# Altium project ControllerV0.PrjPcb (part 2 of 3)
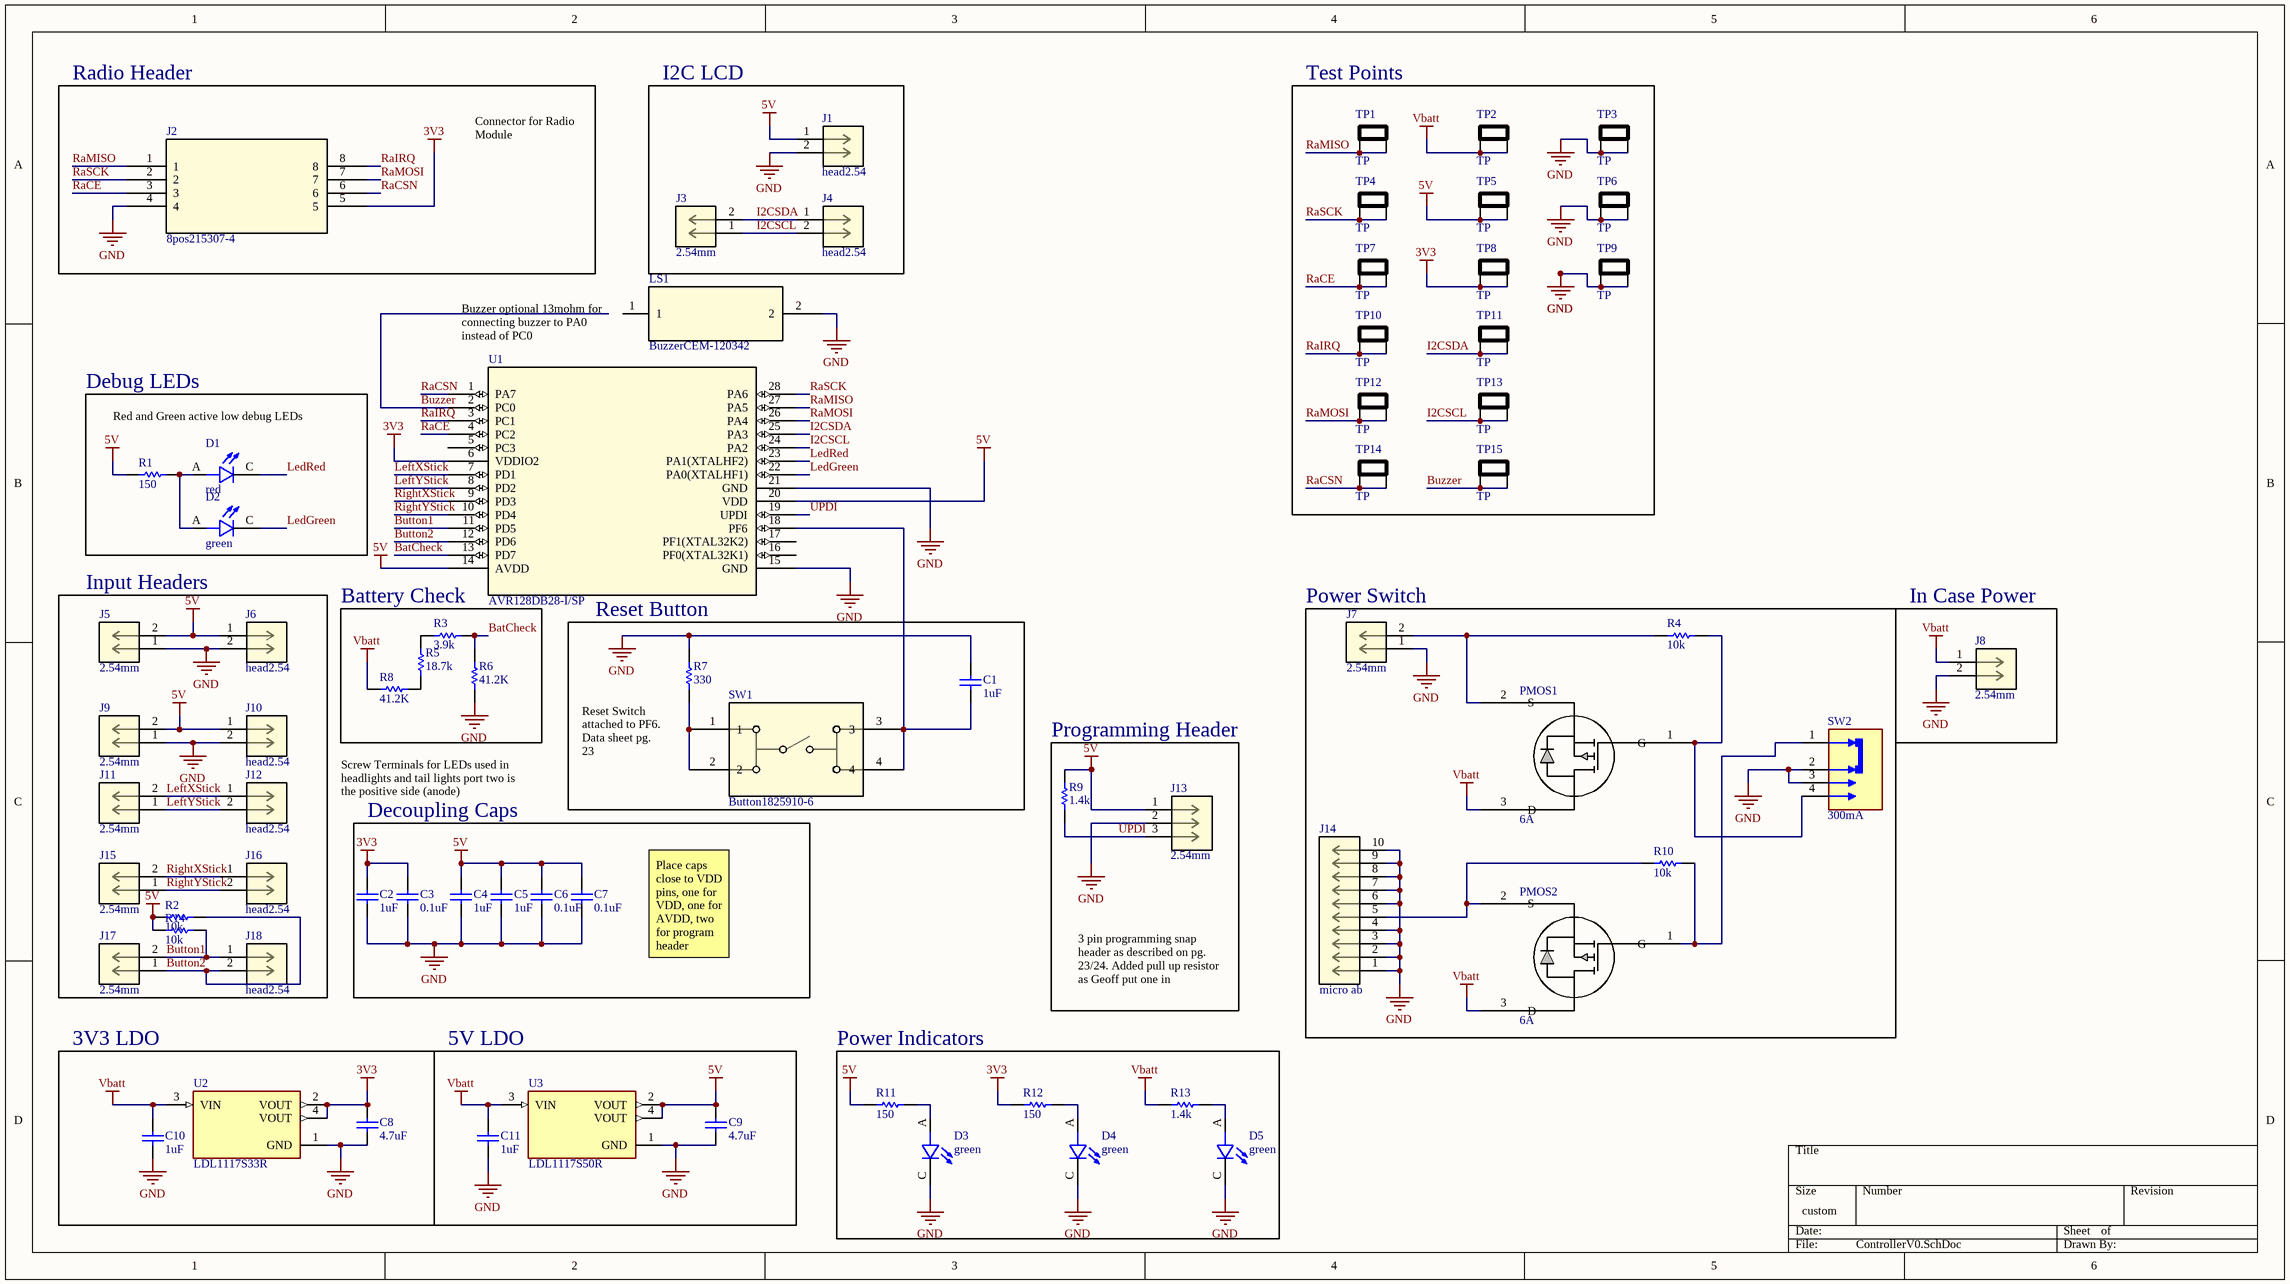
[diagram p1: ControllerV0.SchDoc]

## Sheet ControllerV0.SchDoc (continued)
### Library data of the parts
C1 C2 C4 C5 C10 C11 = CAP CER 1uF 10% 50V 0805: Ceramic Capacitor, Multilayer, Ceramic, 50V, 10% +Tol, 10% -Tol, X7R, 15% TC, 1uF, Surface Mount, 0805; Manufacturer: Samsung; Manufacturer Part Number: CL21B105KBFNNNE; Multilayer: Yes; Supplier: Digikey; Supplier Part Number: 1276-1029-1-ND; RoHS: Yes; Category: Ceramic Capacitors; Stock: 572828; Pricing: 1=0.1, 10=0.051, 100=0.0321, 1000=0.02181 (USD); Mounting Technology: Surface Mount; Pins: 2; Dielectric Material: Ceramic; Package Shape: Rectangular; Case/Package: 0805; Terminal Finish: Nickel; Min Operating Temperature: -55°C; Max Operating Temperature: 125°C; JESD-609 Code: e3; Value: 1uF; Capacitor Type: Ceramic; Tolerance  (fill in as +-): 10%; Package Style: SMTMeter; Packaging: Tape and Reel; Tolerance (fill in as +-): 10%; Rated DC Voltage (URdc): 50V; Temperature Characteristics Code: X7R; Termination: Wraparound; Length: 2mm; Width: 1.25mm; Height: 1.35mm; Reach SVHC Compliant: Yes; RoHS Compliant: Yes; ComponentLink1URL: https://datasheet.ciiva.com:443/pdfs/VipMasterIC/IC/SEMS/SEMS-S-A0008524728/SEMS-S-A0008523023-1.pdf?src-supplier=IHS+Markit; ComponentLink1Description: https://datasheet.ciiva.com:443/pdfs/VipMasterIC/IC/SEMS/SEMS-S-A0008524728/SEMS-S-A0008523023-1.pdf?src-supplier=IHS+Markit; ComponentLink2URL: https://datasheet.ciiva.com/25800/cl21b105kbfnnne-25800291.pdf?src-supplier=Digikey; ComponentLink2Description: https://datasheet.ciiva.com/25800/cl21b105kbfnnne-25800291.pdf?src-supplier=Digikey; ComponentLink3URL: https://datasheet.ciiva.com/16449/cl21b105kbfnnne-16449003.pdf?src-supplier=Future+Electronics; ComponentLink3Description: https://datasheet.ciiva.com/16449/cl21b105kbfnnne-16449003.pdf?src-supplier=Future+Electronics
C3 C6 C7 = CAP CER 0.1uF 10% 50V 0805: Ceramic Capacitor, Multilayer, Ceramic, 50V, 10% +Tol, 10% -Tol, X7R, 15% TC, 0.1uF, Surface Mount, 0805; Manufacturer: Yageo; Manufacturer Part Number: CC0805KRX7R9BB104; Value: 100nF; Multilayer: Yes; Supplier: Digikey; Supplier Part Number: 311-1140-1-ND; RoHS: Yes; Category: Ceramic Capacitors; Stock: 3691132; Pricing: 1=0.08, 10=0.021, 100=0.0152, 1000=0.0144, 4000=0.0112, 8000=0.0104, 12000=0.01, 20000=0.00985 (USD); Mounting Technology: Surface Mount; Pins: 2; Dielectric Material: Ceramic; Package Shape: Rectangular; Case/Package: 0805; Terminal Finish: Nickel; Min Operating Temperature: -55°C; Max Operating Temperature: 125°C; JESD-609 Code: e3; Capacitor Type: Ceramic; Tolerance  (fill in as +-): 10%; Package Style: SMTMeter; Packaging: Tape and Reel; Tolerance (fill in as +-): 10%; Rated DC Voltage (URdc): 50V; Temperature Characteristics Code: X7R; Termination: Wraparound; Length: 2mm; Width: 1.25mm; Height: 0.85mm; Reach SVHC Compliant: Yes; RoHS Compliant: Yes; ComponentLink1URL: https://datasheet.ciiva.com:443/pdfs/VipMasterIC/IC/YAGO/YAGO-S-A0003557223/YAGO-S-A0003557223-1.pdf?src-supplier=IHS+Markit; ComponentLink1Description: https://datasheet.ciiva.com:443/pdfs/VipMasterIC/IC/YAGO/YAGO-S-A0003557223/YAGO-S-A0003557223-1.pdf?src-supplier=IHS+Markit; ComponentLink2URL: https://datasheet.ciiva.com/11786/0900766b80d84f1d-11786009.pdf?src-supplier=Rs; ComponentLink2Description: https://datasheet.ciiva.com/11786/0900766b80d84f1d-11786009.pdf?src-supplier=Rs; ComponentLink3URL: https://datasheet.ciiva.com/155/mlccorderingcode-155929.pdf?src-supplier=Digikey; ComponentLink3Description: https://datasheet.ciiva.com/155/mlccorderingcode-155929.pdf?src-supplier=Digikey; ComponentLink4URL: https://datasheet.ciiva.com/155/mlccorderingcode-155930.pdf?src-supplier=Digikey; ComponentLink4Description: https://datasheet.ciiva.com/155/mlccorderingcode-155930.pdf?src-supplier=Digikey; ComponentLink5URL: https://datasheet.ciiva.com/155/mlccorderingcode-155931.pdf?src-supplier=Digikey; ComponentLink5Description: https://datasheet.ciiva.com/155/mlccorderingcode-155931.pdf?src-supplier=Digikey; ComponentLink6URL: https://datasheet.ciiva.com/46393/1734573-46393307.pdf?src-supplier=Element14; ComponentLink6Description: https://datasheet.ciiva.com/46393/1734573-46393307.pdf?src-supplier=Element14; ComponentLink7URL: https://datasheet.ciiva.com/28450/1489800-28450805.pdf?src-supplier=Element14; ComponentLink7Description: https://datasheet.ciiva.com/28450/1489800-28450805.pdf?src-supplier=Element14; ComponentLink8URL: https://datasheet.ciiva.com/11464/upy-gphc-x7r-6-3v-to-50v-8-11464757.pdf?src-supplier=Avnet; ComponentLink8Description: https://datasheet.ciiva.com/11464/upy-gphc-x7r-6-3v-to-50v-8-11464757.pdf?src-supplier=Avnet; ComponentLink9URL: https://datasheet.ciiva.com/29242/445210-da-01-en-kerko-chip-0805-x7r-0-1uf-10proz-50vg-29242074.pdf?src-supplier=Conrad; ComponentLink9Description: https://datasheet.ciiva.com/29242/445210-da-01-en-kerko-chip-0805-x7r-0-1uf-10proz-50vg-29242074.pdf?src-supplier=Conrad
C8 C9 = CAP CER 4.7uF 10% 25V 0805: Ceramic Capacitor, Multilayer, Ceramic, 25V, 10% +Tol, 10% -Tol, X5R, 15% TC, 4.7uF, Surface Mount, 0805; Manufacturer: Samsung; Manufacturer Part Number: CL21A475KAQNNNE; Multilayer: Yes; ComponentLink1Description: https://www.digikey.ca/en/products/detail/samsung-electro-mechanics/CL21A475KAQNNNE/3886902; ComponentLink1URL: *; Supplier: Digikey; Supplier Part Number: 1276-1244-1-ND; RoHS: Yes; Category: Ceramic Capacitors; Stock: 2691488; Pricing: 1=0.1, 10=0.048, 100=0.03, 1000=0.02035 (USD); Mounting Technology: Surface Mount; Pins: 2; Dielectric Material: Ceramic; Package Shape: Rectangular; Case/Package: 0805; Terminal Finish: Nickel; Min Operating Temperature: -55°C; Max Operating Temperature: 85°C; JESD-609 Code: e3; Value: 4.7uF; Capacitor Type: Ceramic; Tolerance  (fill in as +-): 10%; Package Style: SMTMeter; Packaging: Tape and Reel; Tolerance (fill in as +-): 10%; Rated DC Voltage (URdc): 25V; Temperature Characteristics Code: X5R; Termination: Wraparound; Length: 2mm; Width: 1.25mm; Height: 1.4mm; Reach SVHC Compliant: Yes; RoHS Compliant: Yes; ComponentLink2URL: https://datasheet.ciiva.com:443/pdfs/VipMasterIC/IC/SEMS/SEMS-S-A0008528919/SEMS-S-A0008528938-1.pdf?src-supplier=IHS+Markit; ComponentLink2Description: https://datasheet.ciiva.com:443/pdfs/VipMasterIC/IC/SEMS/SEMS-S-A0008528919/SEMS-S-A0008528938-1.pdf?src-supplier=IHS+Markit; ComponentLink3URL: https://datasheet.ciiva.com/25798/cl21a475kaqnnne-25798882.pdf?src-supplier=Digikey; ComponentLink3Description: https://datasheet.ciiva.com/25798/cl21a475kaqnnne-25798882.pdf?src-supplier=Digikey
D1 = LED redSML-D12U1WT86: Single Color LED, Red, Diffused Milky White, 1.2mm; Manufacturer: Rohm; Shape: Rectangular; Forward Current: 20mA; Luminous Intensity-Nom: 63mcd; Channels: 1; Overall Height: 0.55mm; Reverse Voltage-Max: 5V; Supplier: Digikey; Supplier Part Number: SML-D12U1WT86CT-ND; Manufacturer Part Number: SML-D12U1WT86; RoHS: Yes; Category: LEDs; Stock: 145541; Pricing: 1=0.12, 10=0.081, 100=0.0556, 500=0.0438, 1000=0.03986 (USD); Mounting Technology: Surface Mount; Pins: 2; Color: Red; Min Operating Temperature: -40°C; Max Operating Temperature: 85°C; Lens Style: MILKY WHITE; Optoelectronic Device Type: SINGLE COLOR LED; Packaging: Tape and Reel; Size: 1.2mm; Terminal Pitch: 1.65mm; Reach SVHC Compliant: Yes; RoHS Compliant: Yes; ComponentLink1URL: https://datasheet.ciiva.com:443/pdfs/VipMasterIC/IC/ROHM/ROHM-S-A0002134492/ROHM-S-A0002134492-1.pdf?src-supplier=IHS+Markit; ComponentLink1Description: https://datasheet.ciiva.com:443/pdfs/VipMasterIC/IC/ROHM/ROHM-S-A0002134492/ROHM-S-A0002134492-1.pdf?src-supplier=IHS+Markit; ComponentLink2URL: https://www.rohm.com/datasheet/SML-D12U1W?src-supplier=Digikey; ComponentLink2Description: https://www.rohm.com/datasheet/SML-D12U1W?src-supplier=Digikey; ComponentLink3URL: https://datasheet.octopart.com/SML-D12U1WT86-Rohm-datasheet-68298509.pdf?src-supplier=Future+Electronics; ComponentLink3Description: https://datasheet.octopart.com/SML-D12U1WT86-Rohm-datasheet-68298509.pdf?src-supplier=Future+Electronics; ComponentLink4URL: https://datasheet.octopart.com/SML-D12U1WT86-ROHM-datasheet-142144710.pdf?src-supplier=TME; ComponentLink4Description: https://datasheet.octopart.com/SML-D12U1WT86-ROHM-datasheet-142144710.pdf?src-supplier=TME; Color@wavelength: Red; Terminal Finish: Gold; JESD-609 Code: e4; ComponentLink5URL: https://datasheet.ciiva.com:443/pdfs/VipMasterIC/IC/ROHM/ROHMS10041/ROHMS10041-1.pdf?src-supplier=IHS+Markit; ComponentLink5Description: https://datasheet.ciiva.com:443/pdfs/VipMasterIC/IC/ROHM/ROHMS10041/ROHMS10041-1.pdf?src-supplier=IHS+Markit; ComponentLink6URL: https://datasheet.ciiva.com/11774/0900766b80df3ada-11774020.pdf?src-supplier=Rs; ComponentLink6Description: https://datasheet.ciiva.com/11774/0900766b80df3ada-11774020.pdf?src-supplier=Rs; ComponentLink7URL: https://datasheet.ciiva.com/9324/sml-d1-9324826.pdf?src-supplier=Avnet; ComponentLink7Description: https://datasheet.ciiva.com/9324/sml-d1-9324826.pdf?src-supplier=Avnet; ComponentLink8URL: https://datasheet.ciiva.com/2110/sml-d1-2110375.pdf?src-supplier=Digikey; ComponentLink8Description: https://datasheet.ciiva.com/2110/sml-d1-2110375.pdf?src-supplier=Digikey; ComponentLink9URL: https://datasheet.ciiva.com/2110/sml-d1-2110376.pdf?src-supplier=Digikey; ComponentLink9Description: https://datasheet.ciiva.com/2110/sml-d1-2110376.pdf?src-supplier=Digikey; ComponentLink10URL: https://datasheet.ciiva.com/2110/sml-d1-2110377.pdf?src-supplier=Digikey; ComponentLink10Description: https://datasheet.ciiva.com/2110/sml-d1-2110377.pdf?src-supplier=Digikey
D2-D5 = LED greenSML-D12P8WT86: Single Color LED, Pure Green, Diffused Milky White, 1.2mm; Manufacturer: Rohm; Shape: Rectangular; Forward Current: 20mA; Luminous Intensity-Nom: 6.3mcd; Channels: 1; Reverse Voltage-Max: 5V; Overall Height: 0.55mm; Supplier: Digikey; Supplier Part Number: 846-SML-D12P8WT86CT-ND; Manufacturer Part Number: SML-D12P8WT86; RoHS: Yes; Category: LEDs; Stock: 24850; Pricing: 1=0.14, 10=0.094, 100=0.0648, 500=0.05124, 1000=0.04672 (USD); Mounting Technology: Surface Mount; Pins: 2; Color: Green; Color@wavelength: Green; Terminal Finish: Gold; Min Operating Temperature: -40°C; Max Operating Temperature: 85°C; JESD-609 Code: e4; Lens Style: Diffused; Optoelectronic Device Type: SINGLE COLOR LED; Packaging: Tape and Reel; Size: 1.2mm; Terminal Pitch: 1.65mm; Reach SVHC Compliant: Yes; RoHS Compliant: Yes; ComponentLink1URL: https://datasheet.ciiva.com:443/pdfs/VipMasterIC/IC/ROHM/ROHMS10041/ROHMS10041-1.pdf?src-supplier=IHS+Markit; ComponentLink1Description: https://datasheet.ciiva.com:443/pdfs/VipMasterIC/IC/ROHM/ROHMS10041/ROHMS10041-1.pdf?src-supplier=IHS+Markit; ComponentLink2URL: https://datasheet.ciiva.com/2110/sml-d1-2110417.pdf?src-supplier=Digikey; ComponentLink2Description: https://datasheet.ciiva.com/2110/sml-d1-2110417.pdf?src-supplier=Digikey; ComponentLink3URL: https://datasheet.ciiva.com/16488/rohm20sml-d12p8wt86-16488100.pdf?src-supplier=Future+Electronics; ComponentLink3Description: https://datasheet.ciiva.com/16488/rohm20sml-d12p8wt86-16488100.pdf?src-supplier=Future+Electronics; ComponentLink4URL: https://datasheet.ciiva.com/2110/sml-d1-2110418.pdf?src-supplier=Digikey; ComponentLink4Description: https://datasheet.ciiva.com/2110/sml-d1-2110418.pdf?src-supplier=Digikey; ComponentLink5URL: https://datasheet.ciiva.com/2110/sml-d1-2110419.pdf?src-supplier=Digikey; ComponentLink5Description: https://datasheet.ciiva.com/2110/sml-d1-2110419.pdf?src-supplier=Digikey; ComponentLink6URL: https://datasheet.ciiva.com/3161/sml-d1-3161420.pdf?src-supplier=Avnet; ComponentLink6Description: https://datasheet.ciiva.com/3161/sml-d1-3161420.pdf?src-supplier=Avnet
J1 J4 J6 J10 J12 J16 J18 = HEAD 2.54mm 2pos: Board Connector, 2 Contact(s), 1 Row(s), Male, Straight, 0.1 inch Pitch, Solder Terminal, Black Insulator; Manufacturer: Samtec; Manufacturer Part Number: TS-102-G-AA; Option: General Purpose; Contact Pattern: RECTANGULAR; Contact Style: RND PIN-SKT; Filter Feature: No; Mating Information: MULTIPLE MATING PARTS AVAILABLE; Number Of Connectors: 1; Number of Contacts: 2; Body Length: 0.2inch; Plating Thickness: 20uin; Reference Standard: UL; Reliability: COMMERCIAL; Supplier: Digikey; Supplier Part Number: 612-TS-102-G-AA-ND; RoHS: Yes; Category: Connectors; Stock: 9; Pricing: 1=0.7, 50=0.54, 100=0.44, 500=0.37, 1000=0.36 (USD); Mounting Technology: Board; Contact Material: Brass; Contact Finish - Mating: GOLD (20) OVER NICKEL (50); Contact Finish - Termination: Gold (Au) - with Nickel (Ni) barrier; Insulation Color: Black; Insulation Material: Glass; Min Operating Temperature: -55°C; Max Operating Temperature: 125°C; Connector Type: BOARD CONNECTOR; JESD-609 Code: e4; Contact Gender: Male; Mixed Contacts: No; Mounting Style: STRAIGHT; Number Of PCB Rows: 1; Number of Rows Loaded: 1; PCB Contact Pattern: RECTANGULAR; Termination: Solder; Body Breadth: 0.1inch; Mating Contact Pitch: 0.1inch; Terminal Pitch: 2.54mm; Terminal Length: 0.156inch; DIN Conformance: No; IEC Conformance: No; MIL Conformance: No; RoHS Compliant: Yes; Reach SVHC Compliant: No; ComponentLink1URL: https://datasheet.ciiva.com:443/pdfs/VipMasterIC/IC/SAMI/SAMI-S-A0002822123/SAMI-S-A0002822123-1.pdf?src-supplier=IHS+Markit; ComponentLink1Description: https://datasheet.ciiva.com:443/pdfs/VipMasterIC/IC/SAMI/SAMI-S-A0002822123/SAMI-S-A0002822123-1.pdf?src-supplier=IHS+Markit; ComponentLink2URL: http://www.farnell.com/datasheets/1843794.pdf?src-supplier=Farnell; ComponentLink2Description: http://www.farnell.com/datasheets/1843794.pdf?src-supplier=Farnell; ComponentLink3URL: ftp://ftp.samtec.com/webfiles/PDF/ts.pdf?src-supplier=Avnet; ComponentLink3Description: ftp://ftp.samtec.com/webfiles/PDF/ts.pdf?src-supplier=Avnet; ComponentLink4URL: https://datasheet.octopart.com/TS-102-G-AA-Samtec-datasheet-13698575.pdf?src-supplier=Newark; ComponentLink4Description: https://datasheet.octopart.com/TS-102-G-AA-Samtec-datasheet-13698575.pdf?src-supplier=Newark; ComponentLink5URL: https://datasheet.octopart.com/TS-102-G-AA-Samtec-datasheet-97318998.pdf?src-supplier=Samtec; ComponentLink5Description: https://datasheet.octopart.com/TS-102-G-AA-Samtec-datasheet-97318998.pdf?src-supplier=Samtec; ComponentLink6URL: https://datasheet.octopart.com/TS-102-G-AA-Samtec-datasheet-118235246.pdf?src-supplier=Sager+Electronics; ComponentLink6Description: https://datasheet.octopart.com/TS-102-G-AA-Samtec-datasheet-118235246.pdf?src-supplier=Sager+Electronics; ComponentLink7URL: https://datasheet.octopart.com/TS-102-G-AA-Samtec-datasheet-150856305.pdf?src-supplier=Electro+Sonic; ComponentLink7Description: https://datasheet.octopart.com/TS-102-G-AA-Samtec-datasheet-150856305.pdf?src-supplier=Electro+Sonic
J2 = 8pos215307-4: Board Connector, 4 Contact(s), 2 Row(s), Female, Straight, 0.1 inch Pitch, Solder Terminal, Black Insulator, Receptacle; Manufacturer: TE Connectivity; Option: General Purpose; Contact Pattern: RECTANGULAR; Contact Style: BELLOWED TYPE; Dielectric Withstanding Voltage (AC): 750V; Filter Feature: No; Insulation Resistance: 5GR; Number Of Connectors: 1; Number Of PCB Rows: 2; Number of Contacts: 8; Body Breadth: 0.199inch; Body Depth: 0.276inch; PCB Contact Row Spacing: 2.54mm; Plating Thickness: 31uin; Reference Standard: UL; Reliability: COMMERCIAL; Supplier: Avnet; Supplier Part Number: 98K6517; Manufacturer Part Number: 215307-4; RoHS: Yes; Category: Headers and Wire Housings; Stock: 250; Pricing: 1=0.863, 10=0.776, 25=0.761, 50=0.746, 100=0.731 (USD); Mounting Technology: Board; Contact Material: Bronze; Contact Finish - Mating: NOT SPECIFIED; Contact Finish - Termination: Tin (Sn); Insulation Color: Green; Insulation Material: Glass; Min Operating Temperature: -65°C; Max Operating Temperature: 125°C; JESD-609 Code: e3; Connector Type: BOARD CONNECTOR; Body/Shell Style: RECEPTACLE; Contact Gender: Female; Mixed Contacts: No; Mounting Style: STRAIGHT; Number of Rows Loaded: 2; PCB Contact Pattern: RECTANGULAR; Termination: Solder; Mating Contact Pitch: 0.1inch; Mating Contact Row Spacing: 0.1inch; Terminal Length: 0.118inch; Terminal Pitch: 2.54mm; Flammability Rating: UL94 V-0; Reach SVHC Compliant: Yes; RoHS Compliant: Yes; DIN Conformance: No; IEC Conformance: No; MIL Conformance: No; ComponentLink1URL: https://www.te.com:443/usa-en/product-215307-4.html?src-supplier=IHS+Markit; ComponentLink1Description: https://www.te.com:443/usa-en/product-215307-4.html?src-supplier=IHS+Markit; ComponentLink2URL: https://datasheet.ciiva.com/30070/2153074-30070134.pdf?src-supplier=Onlinecomponents.com; ComponentLink2Description: https://datasheet.ciiva.com/30070/2153074-30070134.pdf?src-supplier=Onlinecomponents.com; ComponentLink3URL: https://datasheet.ciiva.com/11748/0900766b804f4b20-11748752.pdf?src-supplier=Rs; ComponentLink3Description: https://datasheet.ciiva.com/11748/0900766b804f4b20-11748752.pdf?src-supplier=Rs; ComponentLink4URL: https://datasheet.ciiva.com/29369/001094904-da-01-en-buchsenleiste-2-reihig-0-0215307-4-29369976.pdf?src-supplier=Conrad; ComponentLink4Description: https://datasheet.ciiva.com/29369/001094904-da-01-en-buchsenleiste-2-reihig-0-0215307-4-29369976.pdf?src-supplier=Conrad; ComponentLink5URL: https://datasheet.ciiva.com/6857/eng-cd-215307-d-basefilename-6857485.pdf?src-supplier=Digikey; ComponentLink5Description: https://datasheet.ciiva.com/6857/eng-cd-215307-d-basefilename-6857485.pdf?src-supplier=Digikey
J3 J5 J7-J9 J11 J15 J17 = CON screw 2pos 2.54mm: Barrier Strip Terminal Block, 6A, 1 Row(s), 1 Deck(s); Manufacturer: On-Shore Technology; Manufacturer Part Number: OSTVN02A150; Fastening Method: SCREW; Additional Feature: STANDARD: UL 94V-0, THERMOPLASTIC; Number of Decks: 1; Number of Ways: 2; Voltage Rating: 125V; Wire/Cable Gauge: 20AWG; Safety Approval: UL,CUL; Supplier: Digikey; Supplier Part Number: ED10561-ND; RoHS: Yes; Category: Terminal Blocks; Stock: 5554; Pricing: 1=0.87, 10=0.64, 25=0.5576, 50=0.5028, 100=0.4549, 250=0.40308, 500=0.37178, 1000=0.34649, 5000=0.30612 (USD); Mounting Technology: Board; Number of Rows: 1; Current Rating: 6A; Terminal and Terminal Block Type: BARRIER STRIP TERMINAL BLOCK; Reach SVHC Compliant: Yes; RoHS Compliant: Yes; ComponentLink1URL: https://datasheet.ciiva.com:443/pdfs/VipMasterIC/IC/ONST/ONSTS00240/ONSTS00114-1.pdf?src-supplier=IHS+Markit; ComponentLink1Description: https://datasheet.ciiva.com:443/pdfs/VipMasterIC/IC/ONST/ONSTS00240/ONSTS00114-1.pdf?src-supplier=IHS+Markit; ComponentLink2URL: https://datasheet.ciiva.com/823/ostvnxxa150-823935.pdf?src-supplier=Digikey; ComponentLink2Description: https://datasheet.ciiva.com/823/ostvnxxa150-823935.pdf?src-supplier=Digikey
J13 = HEAD 2.54mm 3pos: Board Connector, 38 Contact(s), 1 Row(s), Male, Straight, 0.1 inch Pitch, Solder Terminal, Black Insulator; Manufacturer: Samtec; Manufacturer Part Number: TS-103-T-A; Manufacturer Series: TS; Option: General Purpose; Filter Feature: No; Mating Information: MULTIPLE MATING PARTS AVAILABLE; Number of Rows Loaded: 1; Number of Contacts: 38; Contact Pattern: RECTANGULAR; Contact Style: RND PIN-SKT; Body Length: 0.3inch; Plating Thickness: 200uin; Reference Standard: UL; Reliability: COMMERCIAL; Supplier: Digikey; Supplier Part Number: SAM1112-03-ND; RoHS: Yes; Category: Connectors; Stock: 8991; Pricing: 1=0.81, 10=0.689, 100=0.5855, 500=0.5226, 1000=0.49765, 5000=0.47207 (USD); Mounting Technology: Board; Contact Material: Brass; Contact Finish - Mating: TIN OVER COPPER (100); Contact Finish - Termination: TIN OVER COPPER (100); Insulation Color: Black; Insulation Material: Glass; Min Operating Temperature: -55°C; Max Operating Temperature: 105°C; Connector Type: BOARD CONNECTOR; Contact Gender: Male; Mixed Contacts: No; Mounting Style: STRAIGHT; Termination: Solder; JESD-609 Code: e3; Number Of Connectors: 1; Number Of PCB Rows: 1; PCB Contact Pattern: RECTANGULAR; Terminal Pitch: 2.54mm; Body Breadth: 0.1inch; Mating Contact Pitch: 0.1inch; Terminal Length: 0.156inch; DIN Conformance: No; IEC Conformance: No; MIL Conformance: No; RoHS Compliant: Yes; Reach SVHC Compliant: No; ComponentLink1URL: https://datasheet.ciiva.com:443/pdfs/VipMasterIC/IC/SAMI/SAMI-S-A0001504555/SAMI-S-A0001504555-1.pdf?src-supplier=IHS+Markit; ComponentLink1Description: https://datasheet.ciiva.com:443/pdfs/VipMasterIC/IC/SAMI/SAMI-S-A0001504555/SAMI-S-A0001504555-1.pdf?src-supplier=IHS+Markit; ComponentLink2URL: https://datasheet.ciiva.com/410/tx-1xx-x-x-mkt1-410199.pdf?src-supplier=Digikey; ComponentLink2Description: https://datasheet.ciiva.com/410/tx-1xx-x-x-mkt1-410199.pdf?src-supplier=Digikey
J14 = CON USB micro ab: USB Connector, 5 Contact(s), Female, Right Angle, Surface Mount Terminal, Locking, Receptacle; Manufacturer: Molex; Manufacturer Part Number: 47590-0001; Connector Type: TELECOM AND DATACOM CONNECTOR; Option: General Purpose; Additional Feature: Shielded; Board Mounting Option: PEG; Contact Resistance: 30mR; Dielectric Withstanding Voltage (AC): 141V; Durability: 10000Cycles; Empty Shell: No; Insulation Resistance: 1GR; Number Of Connectors: 1; PCB Contact Pattern: RECTANGULAR; Polarization Key: POLAR PIN POSITION; Rated Current (Signal): 1A; Number of Contacts: 5; Body Breadth: 0.118inch; Body Depth: 0.232inch; Body Length: 0.295inch; Reference Standard: UL; Reliability: COMMERCIAL; Supplier: Digikey; Supplier Part Number: WM17144CT-ND; RoHS: Yes; Category: USB Connectors; Stock: 37888; Pricing: 1=0.75, 10=0.636, 25=0.5964, 50=0.568, 100=0.5408, 250=0.50688, 500=0.48264 (USD); Mounting Technology: Cable; Contact Material: Copper Alloy; Contact Finish - Mating: GOLD; Contact Finish - Termination: Gold (Au); Insulation Material: Polymer; Shell Finish: Tin; Shell Material: Stainless Steel; Min Operating Temperature: -30°C; Max Operating Temperature: 85°C; JESD-609 Code: e4; Body/Shell Style: RECEPTACLE; Contact Gender: Female; Filter Feature: No; Mixed Contacts: No; Mounting Style: RIGHT ANGLE; Number Of PCB Rows: 1; Termination: SMD/SMT; Mounting Option 1: LOCKING; Terminal Pitch: 0.6604mm; Reach SVHC Compliant: Yes; RoHS Compliant: Yes; DIN Conformance: No; IEC Conformance: No; MIL Conformance: No; ComponentLink1URL: https://datasheet.ciiva.com:443/pdfs/VipMasterIC/IC/MOLE/MOLE-S-A0000442751/MOLE-S-A0000443003-1.pdf?src-supplier=IHS+Markit; ComponentLink1Description: https://datasheet.ciiva.com:443/pdfs/VipMasterIC/IC/MOLE/MOLE-S-A0000442751/MOLE-S-A0000443003-1.pdf?src-supplier=IHS+Markit; ComponentLink2URL: https://datasheet.ciiva.com/11731/0900766b80dfe0a6-11731294.pdf?src-supplier=Rs; ComponentLink2Description: https://datasheet.ciiva.com/11731/0900766b80dfe0a6-11731294.pdf?src-supplier=Rs; ComponentLink3URL: https://datasheet.ciiva.com/1098/1597781-1098479.pdf?src-supplier=Element14; ComponentLink3Description: https://datasheet.ciiva.com/1098/1597781-1098479.pdf?src-supplier=Element14; ComponentLink4URL: https://datasheet.ciiva.com/16148/0475900001-io-connectors-16148922.pdf?src-supplier=Onlinecomponents.com; ComponentLink4Description: https://datasheet.ciiva.com/16148/0475900001-io-connectors-16148922.pdf?src-supplier=Onlinecomponents.com
LS1 = BuzzerCEM-120342: Audio Signaling/Alarm Devices; Manufacturer: CUI Devices; Supplier: Arrow Electronics; Supplier Part Number: CEM-1203(42); Manufacturer Part Number: CEM-1203(42); RoHS: Yes; Category: Buzzers; Stock: 12257; Pricing: 1=0.5383, 10=0.4658, 25=0.4267, 40=0.4109, 80=0.3857, 230=0.3659, 500=0.365 (USD); ComponentLink1URL: https://www.cuidevices.com/product/resource/digikeypdf/cem-1203-42-.pdf?src-supplier=Digikey; ComponentLink1Description: https://www.cuidevices.com/product/resource/digikeypdf/cem-1203-42-.pdf?src-supplier=Digikey; ComponentLink2URL: https://datasheet.octopart.com/CEM-1203%2842%29-CUI-Devices-datasheet-175926661.pdf?src-supplier=Future+Electronics; ComponentLink2Description: https://datasheet.octopart.com/CEM-1203%2842%29-CUI-Devices-datasheet-175926661.pdf?src-supplier=Future+Electronics; ComponentLink3URL: https://datasheet.octopart.com/CEM-1203%2842%29-Same-Sky-datasheet-182879445.pdf?src-supplier=Electro+Sonic; ComponentLink3Description: https://datasheet.octopart.com/CEM-1203%2842%29-Same-Sky-datasheet-182879445.pdf?src-supplier=Electro+Sonic; ComponentLink4URL: https://datasheet.octopart.com/CEM-1203%2842%29-CUI-Devices-datasheet-175925305.pdf?src-supplier=Master+Electronics; ComponentLink4Description: https://datasheet.octopart.com/CEM-1203%2842%29-CUI-Devices-datasheet-175925305.pdf?src-supplier=Master+Electronics
PMOS1 PMOS2 = MOS PMOS 30V 6A: Power Field-Effect Transistor, 6A I(D), 30V, 0.042ohm, 1-Element, P-Channel, Silicon, Metal-oxide Semiconductor FET; Manufacturer: Toshiba; Manufacturer Part Number: SSM3J372R,LF; Supplier: Digikey; Supplier Part Number: SSM3J372RLFCT-ND; RoHS: No; Category: LDO; Stock: 64640; Pricing: 1=0.35, 10=0.217, 100=0.1361, 500=0.10106, 1000=0.08971 (USD)
R1 R11 R12 = RES 150 1% 0.125 0805: Fixed Resistor, Metal Glaze/thick Film, 0.125W, 150ohm, 150V, 1% +/-Tol, 100ppm/Cel, Surface Mount, 0805; Manufacturer: Yageo; Manufacturer Part Number: RC0805FR-07150RL; Additional Feature: LASER TRIMMABLE; Power: 125mW; Rated Temperature: 70°C; Value: 150R; Temperature Coefficient (ppm/Cel): 100; Package Height: 0.5mm; Package Length: 2mm; Package Width: 1.25mm; Supplier: Digikey; Supplier Part Number: 311-150CRCT-ND; RoHS: Yes; Category: Chip SMD Resistors; Stock: 982514; Pricing: 1=0.1, 10=0.014, 100=0.0112, 1000=0.00918 (USD); Mounting Technology: Surface Mount; Pins: 2; Package Shape: Rectangular; Case/Package: 0805; Terminal Finish: Nickel; Min Operating Temperature: -55°C; Max Operating Temperature: 155°C; Tolerance: 1%; JESD-609 Code: e3; Resistor Type: FIXED RESISTOR; Construction: Chip; Packaging: Tape and Reel; Technology: METAL GLAZE/THICK FILM; Termination: Wraparound; Working Voltage: 150V; Reach SVHC Compliant: Yes; RoHS Compliant: Yes; ComponentLink1URL: https://datasheet.ciiva.com:443/pdfs/VipMasterIC/IC/YAGO/YAGO-S-A0008145938/YAGO-S-A0008145938-1.pdf?src-supplier=IHS+Markit; ComponentLink1Description: https://datasheet.ciiva.com:443/pdfs/VipMasterIC/IC/YAGO/YAGO-S-A0008145938/YAGO-S-A0008145938-1.pdf?src-supplier=IHS+Markit; ComponentLink2URL: https://datasheet.ciiva.com/11819/0900766b8106beab-11819782.pdf?src-supplier=Rs; ComponentLink2Description: https://datasheet.ciiva.com/11819/0900766b8106beab-11819782.pdf?src-supplier=Rs; ComponentLink3URL: https://datasheet.ciiva.com/2456/pyu-r-int-thick-7-2456999.pdf?src-supplier=Digikey; ComponentLink3Description: https://datasheet.ciiva.com/2456/pyu-r-int-thick-7-2456999.pdf?src-supplier=Digikey; ComponentLink4URL: https://datasheet.ciiva.com/2457/pyu-r-int-thick-7-2457000.pdf?src-supplier=Digikey; ComponentLink4Description: https://datasheet.ciiva.com/2457/pyu-r-int-thick-7-2457000.pdf?src-supplier=Digikey; ComponentLink5URL: https://datasheet.ciiva.com/2457/pyu-r-int-thick-7-2457001.pdf?src-supplier=Digikey; ComponentLink5Description: https://datasheet.ciiva.com/2457/pyu-r-int-thick-7-2457001.pdf?src-supplier=Digikey; ComponentLink6URL: https://datasheet.ciiva.com/7660/38627-7660798.pdf?src-supplier=Element14; ComponentLink6Description: https://datasheet.ciiva.com/7660/38627-7660798.pdf?src-supplier=Element14; ComponentLink7URL: https://datasheet.ciiva.com/46447/444164-46447566.pdf?src-supplier=Element14; ComponentLink7Description: https://datasheet.ciiva.com/46447/444164-46447566.pdf?src-supplier=Element14; ComponentLink8URL: https://datasheet.ciiva.com/12668/rc0805-12668251.pdf?src-supplier=Mouser; ComponentLink8Description: https://datasheet.ciiva.com/12668/rc0805-12668251.pdf?src-supplier=Mouser
R2 R4 R10 R14 = RES 10k 1% 0.125 0805: Fixed Resistor, Metal Glaze/thick Film, 0.125W, 10000ohm, 150V, 1% +/-Tol, 100ppm/Cel, Surface Mount, 0805; Manufacturer: Stackpole Electronics; Manufacturer Part Number: RMCF0805FT10K0; Power: 125mW; Rated Temperature: 70°C; Value: 10kR; Temperature Coefficient (ppm/Cel): 100; Package Height: 0.5mm; Package Length: 2mm; Package Width: 1.25mm; Reference Standard: AEC-Q200; Supplier: Digikey; Supplier Part Number: RMCF0805FT10K0CT-ND; RoHS: Yes; Category: Chip SMD Resistors; Stock: 1401146; Pricing: 1=0.1, 10=0.025, 100=0.012, 1000=0.00658, 2500=0.00538 (USD); Mounting Technology: Surface Mount; Pins: 2; Package Shape: Rectangular; Case/Package: 0805; Terminal Finish: Nickel; Min Operating Temperature: -55°C; Max Operating Temperature: 155°C; Tolerance: 1%; JESD-609 Code: e3; Resistor Type: FIXED RESISTOR; Construction: Rectangular; Packaging: Tape and Reel; Technology: METAL GLAZE/THICK FILM; Termination: Wraparound; Working Voltage: 150V; Reach SVHC Compliant: Yes; RoHS Compliant: Yes; ComponentLink1URL: https://datasheet.ciiva.com:443/pdfs/VipMasterIC/IC/SEIE/SEIE-S-A0009541969/SEIE-S-A0009541969-1.pdf?src-supplier=IHS+Markit; ComponentLink1Description: https://datasheet.ciiva.com:443/pdfs/VipMasterIC/IC/SEIE/SEIE-S-A0009541969/SEIE-S-A0009541969-1.pdf?src-supplier=IHS+Markit; ComponentLink2URL: https://datasheet.ciiva.com/15193/getdatasheetpartid-362046-15193525.pdf?src-supplier=Verical; ComponentLink2Description: https://datasheet.ciiva.com/15193/getdatasheetpartid-362046-15193525.pdf?src-supplier=Verical
R3 = RES 3.9k 1% 0.125W 0805: Fixed Resistor, Metal Glaze/thick Film, 0.125W, 3920ohm, 150V, 1% +/-Tol, 100ppm/Cel, Surface Mount, 0805; Manufacturer: Stackpole Electronics; Manufacturer Part Number: RMCF0805FT3K92; Power: 125mW; Rated Temperature: 70°C; Value: 3.92kR; Temperature Coefficient (ppm/Cel): 100; Package Height: 0.5mm; Package Length: 2mm; Package Width: 1.25mm; Reference Standard: AEC-Q200; Supplier: Digikey; Supplier Part Number: RMCF0805FT3K92CT-ND; RoHS: Yes; Category: Chip SMD Resistors; Stock: 141516; Pricing: 1=0.1, 10=0.021, 50=0.0128, 100=0.0105, 500=0.00704, 1000=0.00602 (USD); Mounting Technology: Surface Mount; Pins: 2; Package Shape: Rectangular; Case/Package: 0805; Terminal Finish: Nickel; Min Operating Temperature: -55°C; Max Operating Temperature: 155°C; Tolerance: 1%; JESD-609 Code: e3; Resistor Type: FIXED RESISTOR; Construction: Rectangular; Packaging: Tape and Reel; Technology: METAL GLAZE/THICK FILM; Termination: Wraparound; Working Voltage: 150V; Reach SVHC Compliant: Yes; RoHS Compliant: Yes; ComponentLink1URL: https://datasheet.ciiva.com:443/pdfs/VipMasterIC/IC/SEIE/SEIE-S-A0009541969/SEIE-S-A0009541969-1.pdf?src-supplier=IHS+Markit; ComponentLink1Description: https://datasheet.ciiva.com:443/pdfs/VipMasterIC/IC/SEIE/SEIE-S-A0009541969/SEIE-S-A0009541969-1.pdf?src-supplier=IHS+Markit; ComponentLink2URL: https://datasheet.ciiva.com/3882/40960751s7172021n1174-3882844.pdf?src-supplier=Arrow+Electronics; ComponentLink2Description: https://datasheet.ciiva.com/3882/40960751s7172021n1174-3882844.pdf?src-supplier=Arrow+Electronics; ComponentLink3URL: https://datasheet.ciiva.com/15193/getdatasheetpartid-565526-15193591.pdf?src-supplier=Verical; ComponentLink3Description: https://datasheet.ciiva.com/15193/getdatasheetpartid-565526-15193591.pdf?src-supplier=Verical
R5 = RES 18.7k 1% 0.125W 0805: Fixed Resistor, Metal Glaze/thick Film, 0.125W, 18700ohm, 150V, 1% +/-Tol, 100ppm/Cel, Surface Mount, 0805; Manufacturer: Stackpole Electronics; Manufacturer Part Number: RMCF0805FT18K7; Power: 125mW; Rated Temperature: 70°C; Value: 18.7kR; Temperature Coefficient (ppm/Cel): 100; Package Height: 0.5mm; Package Length: 2mm; Package Width: 1.25mm; Reference Standard: AEC-Q200; Supplier: Digikey; Supplier Part Number: RMCF0805FT18K7CT-ND; RoHS: Yes; Category: Chip SMD Resistors; Stock: 214137; Pricing: 1=0.1, 10=0.025, 100=0.012, 1000=0.00628, 2500=0.00538 (USD); Mounting Technology: Surface Mount; Pins: 2; Package Shape: Rectangular; Case/Package: 0805; Terminal Finish: Nickel; Min Operating Temperature: -55°C; Max Operating Temperature: 155°C; Tolerance: 1%; JESD-609 Code: e3; Resistor Type: FIXED RESISTOR; Construction: Rectangular; Packaging: Tape and Reel; Technology: METAL GLAZE/THICK FILM; Termination: Wraparound; Working Voltage: 150V; Reach SVHC Compliant: Yes; RoHS Compliant: Yes; ComponentLink1URL: https://datasheet.ciiva.com:443/pdfs/VipMasterIC/IC/SEIE/SEIE-S-A0009541969/SEIE-S-A0009541969-1.pdf?src-supplier=IHS+Markit; ComponentLink1Description: https://datasheet.ciiva.com:443/pdfs/VipMasterIC/IC/SEIE/SEIE-S-A0009541969/SEIE-S-A0009541969-1.pdf?src-supplier=IHS+Markit; ComponentLink2URL: http://components.arrow.com/part/dataview/50586056S357577N1174?src-supplier=Arrow+Electronics; ComponentLink2Description: http://components.arrow.com/part/dataview/50586056S357577N1174?src-supplier=Arrow+Electronics; ComponentLink3URL: https://www.seielect.com/catalog/sei-rmcf_rmcp.pdf?src-supplier=Digikey; ComponentLink3Description: https://www.seielect.com/catalog/sei-rmcf_rmcp.pdf?src-supplier=Digikey; ComponentLink4URL: https://www.seielect.com/catalog/SEI-RMCF_RMCP.pdf?src-supplier=Avnet; ComponentLink4Description: https://www.seielect.com/catalog/SEI-RMCF_RMCP.pdf?src-supplier=Avnet; ComponentLink5URL: https://datasheet.octopart.com/RMCF0805FT18K7-Stackpole-Electronics-datasheet-28504820.pdf?src-supplier=Future+Electronics; ComponentLink5Description: https://datasheet.octopart.com/RMCF0805FT18K7-Stackpole-Electronics-datasheet-28504820.pdf?src-supplier=Future+Electronics
R6 R8 = RES 41.2K 1% 0.125W 0805: Fixed Resistor, Metal Glaze/thick Film, 0.125W, 41200ohm, 150V, 1% +/-Tol, 100ppm/Cel, Surface Mount, 0805; Manufacturer: Vishay; Manufacturer Part Number: CRCW080541K2FKEA; Power: 125mW; Value: 41.2kR; Temperature Coefficient (ppm/Cel): 100; Rated Temperature: 70°C; Package Height: 0.45mm; Package Length: 2mm; Package Width: 1.25mm; Reference Standard: AEC-Q200; Supplier: Arrow Electronics; Supplier Part Number: CRCW080541K2FKEA; RoHS: Yes; Category: Chip SMD Resistors; Stock: 1; Pricing: 1=0.0041 (USD); Mounting Technology: Surface Mount; Pins: 2; Case/Package: 0805; Terminal Finish: Nickel; Package Shape: Rectangular; Min Operating Temperature: -55°C; Max Operating Temperature: 155°C; Tolerance: 1%; JESD-609 Code: e3; Resistor Type: FIXED RESISTOR; Construction: Chip; Packaging: Tape and Reel; Technology: METAL GLAZE/THICK FILM; Working Voltage: 150V; Termination: Wraparound; Reach SVHC Compliant: Yes; RoHS Compliant: Yes; ComponentLink1URL: https://datasheet.ciiva.com:443/pdfs/VipMasterIC/IC/VISH/VISH-S-A0007266705/VISH-S-A0007266705-1.pdf?src-supplier=IHS+Markit; ComponentLink1Description: https://datasheet.ciiva.com:443/pdfs/VipMasterIC/IC/VISH/VISH-S-A0007266705/VISH-S-A0007266705-1.pdf?src-supplier=IHS+Markit; ComponentLink2URL: https://datasheet.ciiva.com/2467/dcrcwe3-2467875.pdf?src-supplier=Digikey; ComponentLink2Description: https://datasheet.ciiva.com/2467/dcrcwe3-2467875.pdf?src-supplier=Digikey; ComponentLink3URL: https://datasheet.ciiva.com/2467/dcrcwe3-2467876.pdf?src-supplier=Digikey; ComponentLink3Description: https://datasheet.ciiva.com/2467/dcrcwe3-2467876.pdf?src-supplier=Digikey; ComponentLink4URL: https://datasheet.ciiva.com/2467/dcrcwe3-2467877.pdf?src-supplier=Digikey; ComponentLink4Description: https://datasheet.ciiva.com/2467/dcrcwe3-2467877.pdf?src-supplier=Digikey; ComponentLink5URL: https://datasheet.ciiva.com/9009/dcrcwe3-9009672.pdf?src-supplier=Avnet; ComponentLink5Description: https://datasheet.ciiva.com/9009/dcrcwe3-9009672.pdf?src-supplier=Avnet; ComponentLink6URL: https://datasheet.ciiva.com/5552/dcrcwe3-109170-5552669.pdf?src-supplier=Mouser; ComponentLink6Description: https://datasheet.ciiva.com/5552/dcrcwe3-109170-5552669.pdf?src-supplier=Mouser; ComponentLink7URL: https://datasheet.ciiva.com/7671/1697337-7671701.pdf?src-supplier=Element14; ComponentLink7Description: https://datasheet.ciiva.com/7671/1697337-7671701.pdf?src-supplier=Element14; ComponentLink8URL: https://datasheet.ciiva.com/7725/125364-7725967.pdf?src-supplier=Element14; ComponentLink8Description: https://datasheet.ciiva.com/7725/125364-7725967.pdf?src-supplier=Element14; ComponentLink9URL: https://datasheet.ciiva.com/22702/1697337-22702910.pdf?src-supplier=Element14; ComponentLink9Description: https://datasheet.ciiva.com/22702/1697337-22702910.pdf?src-supplier=Element14; ComponentLink10URL: https://datasheet.ciiva.com/16200/dcrcwe3-16200485.pdf?src-supplier=Future+Electronics; ComponentLink10Description: https://datasheet.ciiva.com/16200/dcrcwe3-16200485.pdf?src-supplier=Future+Electronics
R7 = RES 330 1% 0.125W 0805: Fixed Resistor, Metal Glaze/thick Film, 0.125W, 330ohm, 150V, 1% +/-Tol, 100ppm/Cel, Surface Mount, 0805; Manufacturer: Stackpole Electronics; Manufacturer Part Number: RMCF0805FT330R; Power: 125mW; Rated Temperature: 70°C; Value: 330R; Temperature Coefficient (ppm/Cel): 100; Package Height: 0.5mm; Package Length: 2mm; Package Width: 1.25mm; Reference Standard: AEC-Q200; Supplier: Digikey; Supplier Part Number: RMCF0805FT330RCT-ND; RoHS: Yes; Category: Chip SMD Resistors; Stock: 270482; Pricing: 1=0.1, 10=0.025, 100=0.012, 1000=0.00658, 2500=0.00564 (USD); Mounting Technology: Surface Mount; Pins: 2; Package Shape: Rectangular; Case/Package: 0805; Terminal Finish: Nickel; Min Operating Temperature: -55°C; Max Operating Temperature: 155°C; Tolerance: 1%; JESD-609 Code: e3; Resistor Type: FIXED RESISTOR; Construction: Rectangular; Packaging: Tape and Reel; Technology: METAL GLAZE/THICK FILM; Termination: Wraparound; Working Voltage: 150V; Reach SVHC Compliant: Yes; RoHS Compliant: Yes; ComponentLink1URL: https://datasheet.ciiva.com:443/pdfs/VipMasterIC/IC/SEIE/SEIE-S-A0009541969/SEIE-S-A0009541969-1.pdf?src-supplier=IHS+Markit; ComponentLink1Description: https://datasheet.ciiva.com:443/pdfs/VipMasterIC/IC/SEIE/SEIE-S-A0009541969/SEIE-S-A0009541969-1.pdf?src-supplier=IHS+Markit; ComponentLink2URL: http://components.arrow.com/part/dataview/40963487S9848862N1174?src-supplier=Arrow+Electronics; ComponentLink2Description: http://components.arrow.com/part/dataview/40963487S9848862N1174?src-supplier=Arrow+Electronics; ComponentLink3URL: https://www.seielect.com/catalog/SEI-RMCF_RMCP.pdf?src-supplier=Avnet; ComponentLink3Description: https://www.seielect.com/catalog/SEI-RMCF_RMCP.pdf?src-supplier=Avnet; ComponentLink4URL: https://www.seielect.com/catalog/sei-rmcf_rmcp.pdf?src-supplier=Digikey; ComponentLink4Description: https://www.seielect.com/catalog/sei-rmcf_rmcp.pdf?src-supplier=Digikey; ComponentLink5URL: https://www.seielect.com/catalog/SEI-Packaging.pdf?src-supplier=Digikey; ComponentLink5Description: https://www.seielect.com/catalog/SEI-Packaging.pdf?src-supplier=Digikey; ComponentLink6URL: https://www.verical.com/server-webapp/html/getDatasheet?partID=559884&src-supplier=Verical; ComponentLink6Description: https://www.verical.com/server-webapp/html/getDatasheet?partID=559884&src-supplier=Verical; ComponentLink7URL: https://datasheet.octopart.com/RMCF0805FT330R-Stackpole-Electronics-datasheet-12534581.pdf?src-supplier=Future+Electronics; ComponentLink7Description: https://datasheet.octopart.com/RMCF0805FT330R-Stackpole-Electronics-datasheet-12534581.pdf?src-supplier=Future+Electronics
R9 R13 = RES 1.4k 1% 0.125W 0805: Fixed Resistor, Metal Glaze/thick Film, 0.125W, 1400ohm, 150V, 1% +/-Tol, 100ppm/Cel, Surface Mount, 0805; Manufacturer: Yageo; Manufacturer Part Number: RC0805FR-071K4L; Additional Feature: LASER TRIMMABLE; Power: 125mW; Rated Temperature: 70°C; Value: 1.4kR; Temperature Coefficient (ppm/Cel): 100; Package Height: 0.5mm; Package Length: 2mm; Package Width: 1.25mm; Supplier: Future Electronics; Supplier Part Number: 5205166; RoHS: Yes; Category: Chip SMD Resistors; Stock: 70000; Pricing: 5000=0.0021, 20000=0.002, 100000=0.0019, 200000=0.0018, 625000=0.0017 (USD); Mounting Technology: Surface Mount; Pins: 2; Package Shape: Rectangular; Case/Package: 0805; Terminal Finish: Nickel; Min Operating Temperature: -55°C; Max Operating Temperature: 155°C; Tolerance: 1%; JESD-609 Code: e3; Resistor Type: FIXED RESISTOR; Construction: Chip; Packaging: Tape and Reel; Technology: METAL GLAZE/THICK FILM; Termination: Wraparound; Working Voltage: 150V; Reach SVHC Compliant: Yes; RoHS Compliant: Yes; ComponentLink1URL: https://datasheet.ciiva.com:443/pdfs/VipMasterIC/IC/YAGO/YAGO-S-A0008145938/YAGO-S-A0008145938-1.pdf?src-supplier=IHS+Markit; ComponentLink1Description: https://datasheet.ciiva.com:443/pdfs/VipMasterIC/IC/YAGO/YAGO-S-A0008145938/YAGO-S-A0008145938-1.pdf?src-supplier=IHS+Markit; ComponentLink2URL: https://datasheet.ciiva.com/2519/pyu-r-int-thick-7-2519780.pdf?src-supplier=Digikey; ComponentLink2Description: https://datasheet.ciiva.com/2519/pyu-r-int-thick-7-2519780.pdf?src-supplier=Digikey; ComponentLink3URL: https://datasheet.ciiva.com/2519/pyu-r-int-thick-7-2519781.pdf?src-supplier=Digikey; ComponentLink3Description: https://datasheet.ciiva.com/2519/pyu-r-int-thick-7-2519781.pdf?src-supplier=Digikey; ComponentLink4URL: https://datasheet.ciiva.com/2519/pyu-r-int-thick-7-2519782.pdf?src-supplier=Digikey; ComponentLink4Description: https://datasheet.ciiva.com/2519/pyu-r-int-thick-7-2519782.pdf?src-supplier=Digikey; ComponentLink5URL: https://datasheet.ciiva.com/5596/rc0805-5596057.pdf?src-supplier=Mouser; ComponentLink5Description: https://datasheet.ciiva.com/5596/rc0805-5596057.pdf?src-supplier=Mouser; ComponentLink6URL: https://datasheet.ciiva.com/17033/rc0805-17033654.pdf?src-supplier=Future+Electronics; ComponentLink6Description: https://datasheet.ciiva.com/17033/rc0805-17033654.pdf?src-supplier=Future+Electronics
SW1 = Button1825910-6: Keypad Switch, 1 Switches, SPST, Momentary-tactile, 0.05A, 24VDC, 2.06N, 4 PCB Hole Cnt, Solder Terminal, Through Hole-straight; Manufacturer: TE Connectivity Alcoswitch; Circuit Configuration: 1X1; Contact Current(DC)-Max: 50mA; Contact DC Max Rating R Load: .05A@24VDC; Contact Voltage(DC)-Max: 24V; Number of Switches: 1; Body Breadth: 5.99mm; Body Height: 3.61mm; Supplier: Avnet; Supplier Part Number: 1825910-6; Manufacturer Part Number: 1825910-6; RoHS: Yes; Category: Pushbutton Switches; Stock: 150345; Pricing: 1=0.04963, 10=0.04908, 30=0.04866, 50=0.04823, 100=0.0478 (USD); Mounting Technology: Through Hole; Min Operating Temperature: -35°C; Max Operating Temperature: 85°C; Termination: Solder; Operating Force-Max: 2.06N; Switch Action: MOMENTARY; Switch Function: SPST; Switch Type: Keypad; Body Length or Diameter: 5.99mm; Reach SVHC Compliant: Yes; RoHS Compliant: Yes; ComponentLink1URL: https://datasheet.ciiva.com:443/pdfs/VipMasterIC/IC/TYEL/TYEL-S-A0008869674/TYEL-S-A0008850909-1.pdf?src-supplier=IHS+Markit; ComponentLink1Description: https://datasheet.ciiva.com:443/pdfs/VipMasterIC/IC/TYEL/TYEL-S-A0008869674/TYEL-S-A0008850909-1.pdf?src-supplier=IHS+Markit; ComponentLink2URL: https://datasheet.ciiva.com/30199/1825910-6rqpn1825910-6-30199520.pdf?src-supplier=Onlinecomponents.com; ComponentLink2Description: https://datasheet.ciiva.com/30199/1825910-6rqpn1825910-6-30199520.pdf?src-supplier=Onlinecomponents.com; ComponentLink3URL: https://datasheet.ciiva.com/15184/getdatasheetpartid-395915-15184509.pdf?src-supplier=Verical; ComponentLink3Description: https://datasheet.ciiva.com/15184/getdatasheetpartid-395915-15184509.pdf?src-supplier=Verical
SW2 = SW On-On-On 300mA: 12.7 x 7.5 x 4.5 mm, 2 mm Raised Slide Actuator, Right Angle, Through Hole, Slide Switch; Manufacturer: Same Sky; Manufacturer Part Number: SLW-1277545-2A-RA-S-D; Supplier: Digikey; Supplier Part Number: 2223-SLW-1277545-2A-RA-S-D-ND; RoHS: No; Stock: 2799; Pricing: 1=0.39, 10=0.336, 25=0.314, 100=0.2811, 250=0.26048, 500=0.24582, 1000=0.23217, 3000=0.2128, 5000=0.20479 (USD)
TP1-TP15 = TP clip 0805 RCTCTE: Testing/Accessories; Manufacturer: KOA Speer; Manufacturer Part Number: RCTCTE; Rated Temperature: 70°C; Value: 0R; Package Height: 1.45mm; Package Length: 2mm; Package Width: 1.25mm; Reference Standard: AEC-Q200; Supplier: Digikey; Supplier Part Number: 2019-RCTCTECT-ND; RoHS: Yes; Category: Chip SMD Resistors; Stock: 45761; Pricing: 1=0.14, 10=0.111, 25=0.1024, 50=0.096, 100=0.0904, 250=0.08328, 500=0.0783, 1000=0.07363 (USD); Mounting Technology: Surface Mount; Pins: 2; Package Shape: Rectangular; Case/Package: 0805; Terminal Finish: Copper; Min Operating Temperature: -55°C; Max Operating Temperature: 125°C; JESD-609 Code: e2; Resistor Type: FIXED RESISTOR; Construction: Chip; Packaging: Tape and Reel; Termination: Wraparound; Reach SVHC Compliant: Yes; RoHS Compliant: Yes; ComponentLink1URL: https://datasheet.ciiva.com:443/pdfs/VipMasterIC/IC/KOAS/KOASS03065/KOASS03065-1.pdf?src-supplier=IHS+Markit; ComponentLink1Description: https://datasheet.ciiva.com:443/pdfs/VipMasterIC/IC/KOAS/KOASS03065/KOASS03065-1.pdf?src-supplier=IHS+Markit; ComponentLink2URL: https://datasheet.ciiva.com/5562/rc-5562502.pdf?src-supplier=Mouser; ComponentLink2Description: https://datasheet.ciiva.com/5562/rc-5562502.pdf?src-supplier=Mouser
U1 = AVR128DB28-I/SP: RISC Microcontroller, 8-Bit, FLASH, AVR CPU, 24MHz, CMOS, PDIP28; Manufacturer: Microchip; Supplier: Newark; Supplier Part Number: 12AJ7043; Manufacturer Part Number: AVR128DB28-I/SP; RoHS: No; Category: Microcontrollers; Stock: 41; Pricing: 1=5.04, 10=4.9, 30=4.76, 60=4.62, 105=4.41, 510=4.2 (CAD); ComponentLink1URL: http://ww1.microchip.com/downloads/en/DeviceDoc/AVR128DB28-32-48-64-DataSheet-DS40002247A.pdf?src-supplier=Digikey; ComponentLink1Description: http://ww1.microchip.com/downloads/en/DeviceDoc/AVR128DB28-32-48-64-DataSheet-DS40002247A.pdf?src-supplier=Digikey; ComponentLink2URL: https://datasheet.octopart.com/AVR128DB28-I-SP-Microchip-datasheet-168930144.pdf?src-supplier=microchipDIRECT; ComponentLink2Description: https://datasheet.octopart.com/AVR128DB28-I-SP-Microchip-datasheet-168930144.pdf?src-supplier=microchipDIRECT
U2 = LDL1117S33R: Fixed Positive LDO Regulator, 3.3V, 0.6V Dropout, PDSO4; Manufacturer: STMicroelectronics; Package Body Material: Plastic; Channels: 1; Dropout Voltage1-Max: 600mV; Max Supply Voltage: 18V; Min Input Voltage: 4.3V; Output Current1-Max: 1.2A; Output Voltage1-Max: 3.399V; Output Voltage1-Min: 3.201V; Regulator Type: FIXED POSITIVE SINGLE OUTPUT LDO REGULATOR; Supplier 1: Arrow Electronics; Supplier Part Number 1: LDL1117S33R; Supplier: Arrow Electronics; Supplier Part Number: LDL1117S33R; Manufacturer Part Number: LDL1117S33R; RoHS: Yes; Category: Voltage Regulators - Linear; Stock: 650000; Pricing: 2500=0.294, 5000=0.2911, 7500=0.2135, 12500=0.1452, 17500=0.112, 25000=0.0997 (USD); Case/Package: SOP; Pins: 4; Package Shape: Rectangular; Package Style: SMALL OUTLINEMeter; Surface Mount: Yes; JESD-30 Code: R-PDSO-G4; Operating Temperature, TJ-Max: 125°C; Operating Temperature, TJ-Min: -40°C; Output Voltage1-Nom: 3.3V; Terminal Form: Gull Wing; Terminal Position: DUAL; Length: 6.5mm; Width: 3.5mm; Height - Seated (Max): 1.9mm; Terminal Pitch: 2.3mm; Reach SVHC Compliant: Yes; RoHS Compliant: Yes; ComponentLink1URL: https://datasheet.ciiva.com:443/pdfs/VipMasterIC/IC/SGST/SGST-S-A0010030722/SGST-S-A0010030722-1.pdf?src-supplier=IHS+Markit; ComponentLink1Description: https://datasheet.ciiva.com:443/pdfs/VipMasterIC/IC/SGST/SGST-S-A0010030722/SGST-S-A0010030722-1.pdf?src-supplier=IHS+Markit; ComponentLink2URL: http://www.farnell.com/datasheets/2259188.pdf?src-supplier=Farnell; ComponentLink2Description: http://www.farnell.com/datasheets/2259188.pdf?src-supplier=Farnell; ComponentLink3URL: http://www.st.com/content/ccc/resource/technical/document/datasheet/group3/0e/5a/00/ca/10/1a/4f/a5/DM00366442/files/DM00366442.pdf/jcr:content/translations/en.DM00366442.pdf?src-supplier=Digikey; ComponentLink3Description: http://www.st.com/content/ccc/resource/technical/document/datasheet/group3/0e/5a/00/ca/10/1a/4f/a5/DM00366442/files/DM00366442.pdf/jcr:content/translations/en.DM00366442.pdf?src-supplier=Digikey; ComponentLink4URL: http://www.farnell.com/datasheets/2259188.pdf?src-supplier=Element14; ComponentLink4Description: http://www.farnell.com/datasheets/2259188.pdf?src-supplier=Element14; ComponentLink5URL: http://www.farnell.com/datasheets/2259188.pdf?src-supplier=Newark; ComponentLink5Description: http://www.farnell.com/datasheets/2259188.pdf?src-supplier=Newark; ComponentLink6URL: https://datasheet.octopart.com/LDL1117S33R-STMicroelectronics-datasheet-165583407.pdf?src-supplier=TME; ComponentLink6Description: https://datasheet.octopart.com/LDL1117S33R-STMicroelectronics-datasheet-165583407.pdf?src-supplier=TME